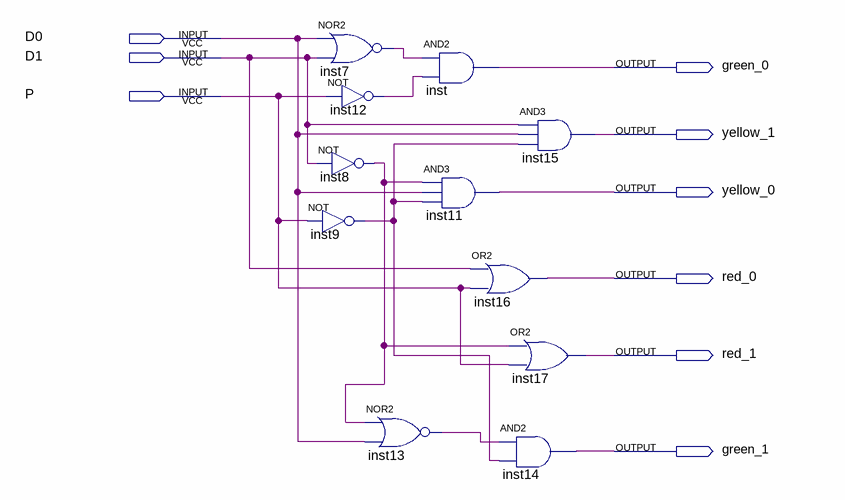
[diagram p0: schematic sheet]
// Quartus schematic Light_controller.bdf as structural Verilog: 11 symbols, 9 pins
module Light_controller (
  input  D0,
  input  D1,
  input  P,
  output green_0,
  output yellow_1,
  output yellow_0,
  output red_0,
  output red_1,
  output green_1
);

  wire inst7_out, inst8_out, inst9_out, inst12_out, inst13_out;

  nor inst7 (inst7_out, D0, D1);
  not inst12 (inst12_out, P);
  not inst8 (inst8_out, D1);
  not inst9 (inst9_out, P);
  nor inst13 (inst13_out, inst8_out, D0);
  and inst (green_0, inst7_out, inst12_out);
  and inst11 (yellow_0, inst8_out, D0, inst9_out);
  or inst16 (red_0, D1, P);
  and inst15 (yellow_1, D1, D0, inst9_out);
  or inst17 (red_1, inst8_out, P);
  and inst14 (green_1, inst13_out, inst9_out);
endmodule
